# EAGLE design WakeOnWifi (EAGLE 7.2.0)
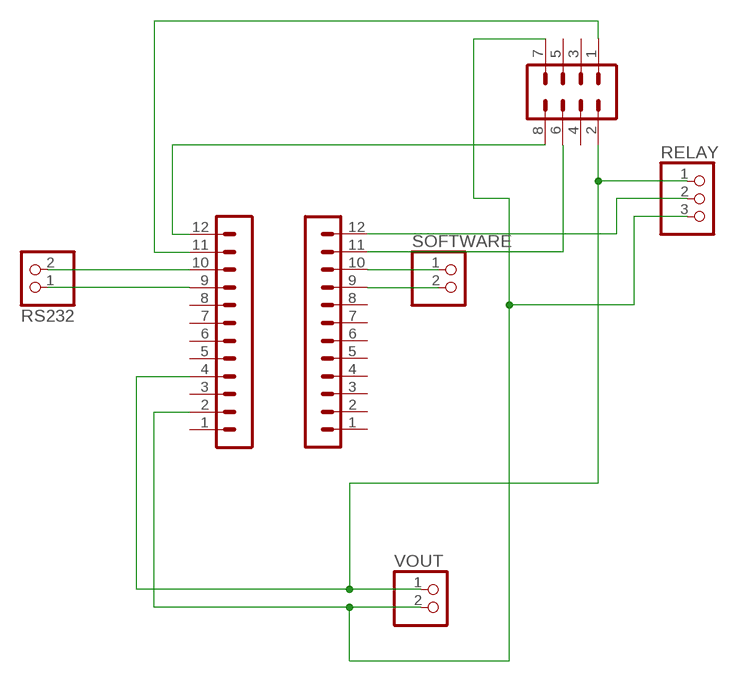
[diagram p0: schematic, sheet 1]

## Parts
ARDUINOLEFT  MA12-1  [MA12-1]
ARDUINORIGHT  MA12-1  [MA12-1]
RELAY  PINHD-1X3  [1X03]
RS232  PINHD-1X2  [1X02]
SOFTWARE  PINHD-1X2  [1X02]
VOUT  PINHD-1X2  [1X02]
WIFI  MA04-2  [MA04-2]

## Nets
N$1: ARDUINOLEFT.2 RELAY.3 VOUT.2 WIFI.7
N$2: ARDUINOLEFT.12 WIFI.8
N$3: ARDUINOLEFT.11 WIFI.1
N$4: ARDUINOLEFT.4 RELAY.1 VOUT.1 WIFI.2
N$5: ARDUINORIGHT.11 WIFI.6
N$6: ARDUINORIGHT.10 SOFTWARE.1
N$7: ARDUINORIGHT.9 SOFTWARE.2
N$8: ARDUINORIGHT.12 RELAY.2
N$9: ARDUINOLEFT.10 RS232.2
N$10: ARDUINOLEFT.9 RS232.1
Unconnected: ARDUINOLEFT.1 ARDUINOLEFT.3 ARDUINOLEFT.5 ARDUINOLEFT.6 ARDUINOLEFT.7 ARDUINOLEFT.8 ARDUINORIGHT.1 ARDUINORIGHT.2 ARDUINORIGHT.3 ARDUINORIGHT.4 ARDUINORIGHT.5 ARDUINORIGHT.6 ARDUINORIGHT.7 ARDUINORIGHT.8 WIFI.3 WIFI.4 WIFI.5

## Library data of the parts
ARDUINOLEFT ARDUINORIGHT = con-lstb:MA12-1: PIN HEADER; OC_FARNELL: unknown; OC_NEWARK: unknown
RELAY = pinhead:PINHD-1X3: PIN HEADER
RS232 SOFTWARE VOUT = pinhead:PINHD-1X2: PIN HEADER
WIFI = con-lstb:MA04-2: PIN HEADER; OC_FARNELL: unknown; OC_NEWARK: unknown

## Board
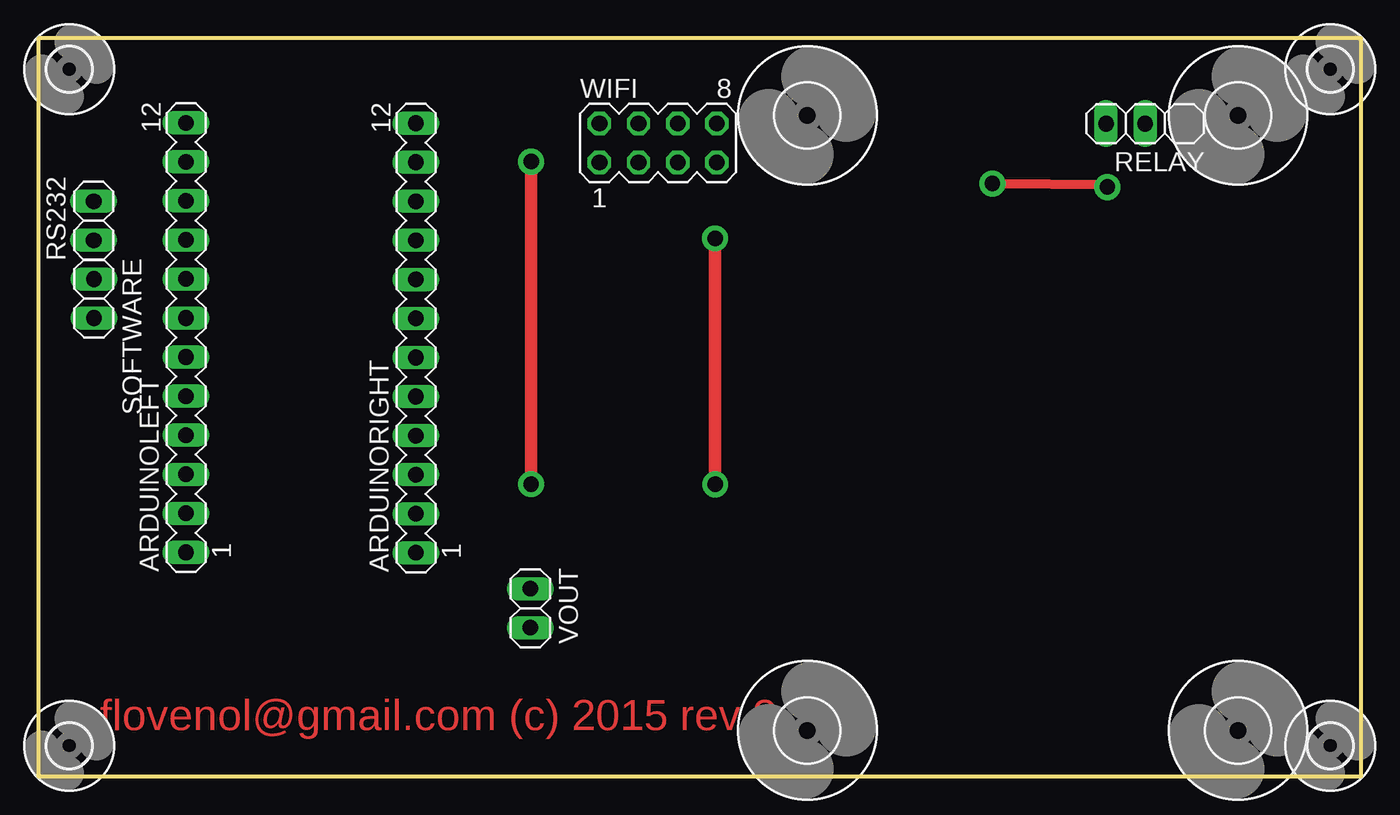
[diagram p1: board, top side]
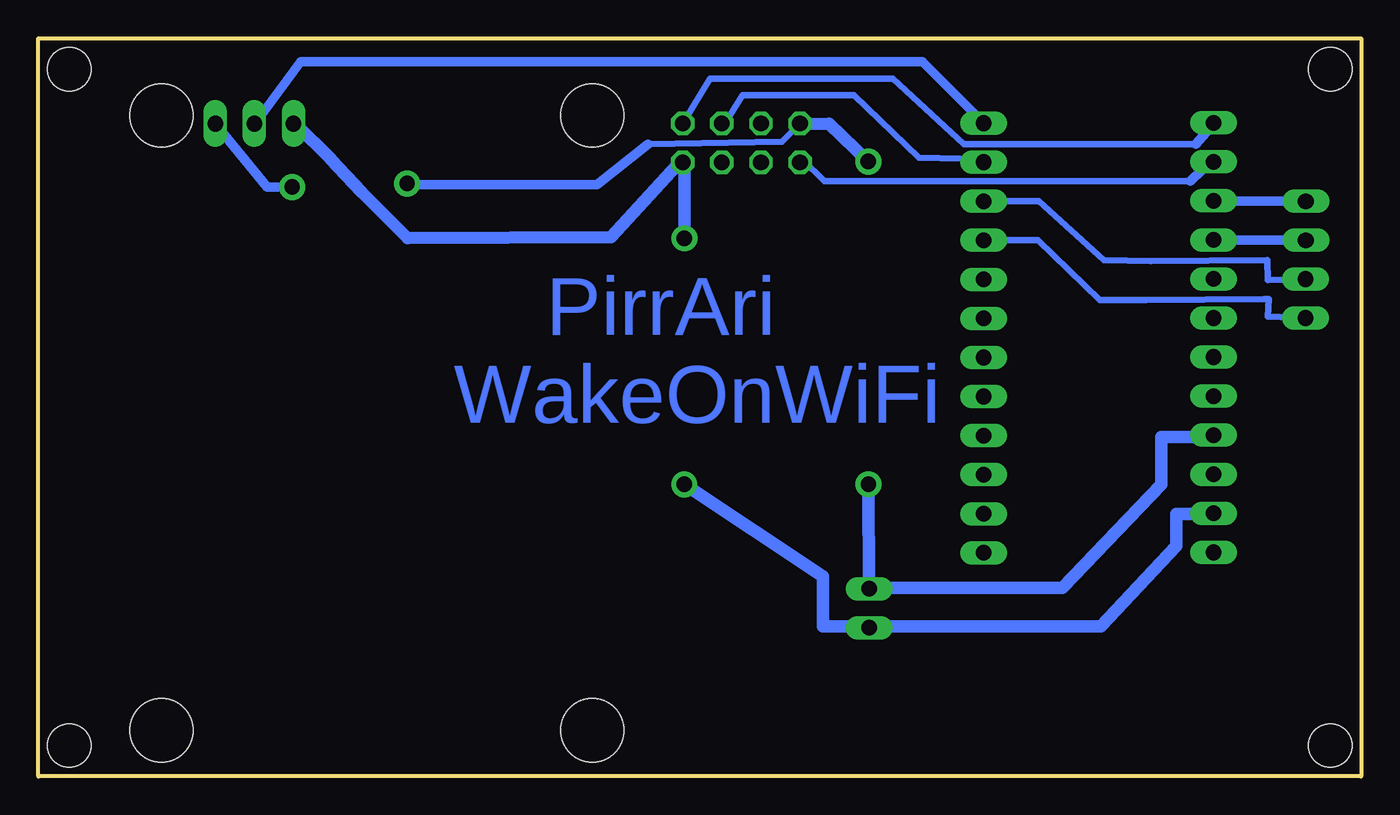
[diagram p2: board, bottom side, seen from below]

Size 86 x 48 mm. Coordinates in mm from the lower left corner, seen from the top.
Outline: 0,0 86,0 86,48 0,48 0,0
Copper layers (1*16): Top 0.035mm / dielectric 1.5mm / Bottom 0.035mm
Design rules "default": minimum track width 10mil, minimum drill 24mil, track to track 8mil, track to pad 8mil, pad to pad 8mil, via to via 8mil, smd to smd 8mil, copper to edge 40mil, drill to drill 8mil, minimum pad ring 10mil, minimum via ring 8mil, stop-mask expansion 4mil, vias tented up to drill 0mil, thermal gap 10mil

### Footprints (pad centres in the part's own frame; a part is rotated, then mirrored left to right if it is on the bottom)
MA12-1 = drill 1.016 long: 1 -13.97,0; 2 -11.43,0; 3 -8.89,0; 4 -6.35,0; 5 -3.81,0; 6 -1.27,0; 7 1.27,0; 8 3.81,0; 9 6.35,0; 10 8.89,0; 11 11.43,0; 12 13.97,0
1X03 = drill 1.016 long: 1 -2.54,0; 2 0,0; 3 2.54,0
1X02 = drill 1.016 long: 1 -1.27,0; 2 1.27,0
2,8 = hole 2.8: 0,0
4,1 = hole 4.1: 0,0
MA04-2 = drill 1.016 octagon: 1 -3.81,-1.27; 2 -3.81,1.27; 3 -1.27,-1.27; 4 -1.27,1.27; 5 1.27,-1.27; 6 1.27,1.27; 7 3.81,-1.27; 8 3.81,1.27

### Placement (x,y rotation side)
ARDUINOLEFT  9.6,28.55 90 top
ARDUINORIGHT  24.55,28.52 90 top
RELAY  71.96,42.46 180 top
RS232  3.59,36.14 90 top
SOFTWARE  3.6,31.08 270 top
U$1  [2,8]  2,46 0 top
U$2  [2,8]  84,46 0 top
U$3  [2,8]  84,2 0 top
U$4  [2,8]  2,2 0 top
U$5  [4,1]  78,43 0 top
U$6  [4,1]  50,43 0 top
U$7  [4,1]  78,3 0 top
U$8  [4,1]  50,3 0 top
VOUT  31.98,10.94 270 top
WIFI  40.29,41.21 0 top

### Tracks (layer width: path | path; a pad name or v marks a point on that pad's centre or on a via)
N$1  (via drill 1 pad 1.68)
  Top 0.813: v44,18.99 v44,35
  Bottom 0.254: 44.12,40.15 WIFI.7 43.89,39.92 | 69.27,42.44 RELAY.3 | 31.77,9.75 VOUT.2 32,9.75 | 9.6,17.06 ARDUINOLEFT.2
  Bottom 0.406: 44,40 44.1,40 WIFI.7
  Bottom 0.813: 44.12,40.15 48.77,35.08 62,35 65,38 67,40.15 66.98,40.15 69.27,42.44 | 31.77,9.75 16.92,9.75 12,15 12,17.06 9.6,17.06 | v44,35 44,40 | 32,9.75 35,9.75 35,13 v44,18.99
N$2
  Bottom 0.254: 43.98,42.67 43.89,42.67 WIFI.8 | 9.6,42.44 ARDUINOLEFT.12
  Bottom 0.406: 43.98,42.67 42.33,45.38 30.45,45.39 25.83,41.14 10.74,41.12
  Bottom 0.61: 9.6,42.44 10.74,41.12
N$3
  Bottom 0.254: 36.35,40.15 WIFI.1 | 9.6,40.15 ARDUINOLEFT.11
  Bottom 0.406: 36.35,40.15 34.89,38.71 26.61,38.71 11.09,38.72
  Bottom 0.61: 9.6,40.15 11.09,38.72
N$4  (via drill 1 pad 1.68)
  Top 0.61: v62.03,38.56 69.58,38.5 v69.51,38.33
  Top 0.813: v32.03,19.01 v32.04,39.99
  Bottom 0.254: 31.77,12.26 VOUT.1 32,12.26 | 9.6,22.09 ARDUINOLEFT.4 | 36.58,42.44 WIFI.2 36.5,42.46
  Bottom 0.406: 46.38,41.14 37.66,41.3 36.5,42.46
  Bottom 0.61: v69.51,38.33 71.14,38.34 RELAY.1 | 46.38,41.14 49.67,38.5 61.27,38.5 v62.03,38.56
  Bottom 0.813: 31.77,12.26 19.43,12.26 13,19 13,22.09 9.6,22.09 | 36.58,42.44 34.59,42.44 v32.04,39.99 | 32,12.26 v32.03,19.01
N$5
  Bottom 0.254: 24.69,40.15 ARDUINORIGHT.11 | 41.38,42.44 WIFI.6
  Bottom 0.406: 24.69,40.15 28.75,40.25 32.96,44.3 40.23,44.3 41.38,42.44
N$6
  Bottom 0.406: ARDUINORIGHT.10 20.96,37.41 16.71,33.59 13.68,33.53 6.1,33.57 6.08,32.28 SOFTWARE.1
N$7
  Bottom 0.406: SOFTWARE.2 6.08,29.92 6,31.05 6.28,31.05 14,31 17,31 21,34.87 ARDUINORIGHT.9
N$8
  Bottom 0.254: 71.78,42.67 RELAY.2 | 24.69,42.67 ARDUINORIGHT.12
  Bottom 0.61: 71.78,42.67 68.95,46.5 28.52,46.5 24.69,42.67
N$9
  Bottom 0.254: 3.66,37.41 RS232.2 | 9.37,37.41 ARDUINOLEFT.10
  Bottom 0.61: 9.37,37.41 3.66,37.41
N$10
  Bottom 0.254: 3.66,34.89 RS232.1 | 9.37,34.89 ARDUINOLEFT.9
  Bottom 0.61: 9.37,34.89 3.66,34.89

### Text on the board
Top: flovenol@gmail.com (c) 2015 rev 2
Bottom: PirrAri / WakeOnWiFi